# Altium schematic sheet TOPSHEET.SchDoc: TOPSHEET
size A4; Date: 31 08 2013; Author: Rachid AKKOUCHE; CompanyName: MDI; DrawnBy: Rachid AKKOUCHE; Engineer: Rachid AKKOUCHE; Organization: RASoftware; Address1: 52 J03 rue de la crèche; Address2: 77100 MEAUX; Address3: FRANCE; DocumentNumber: BRA2013090103C1; Revision: C; SheetNumber: 1; SheetTotal: 4; Telephone: +33651604047; Email: rachid.akkouche@wanadoo.fr; Dessinepar: -; Verifiepar: -; Time: 13:22
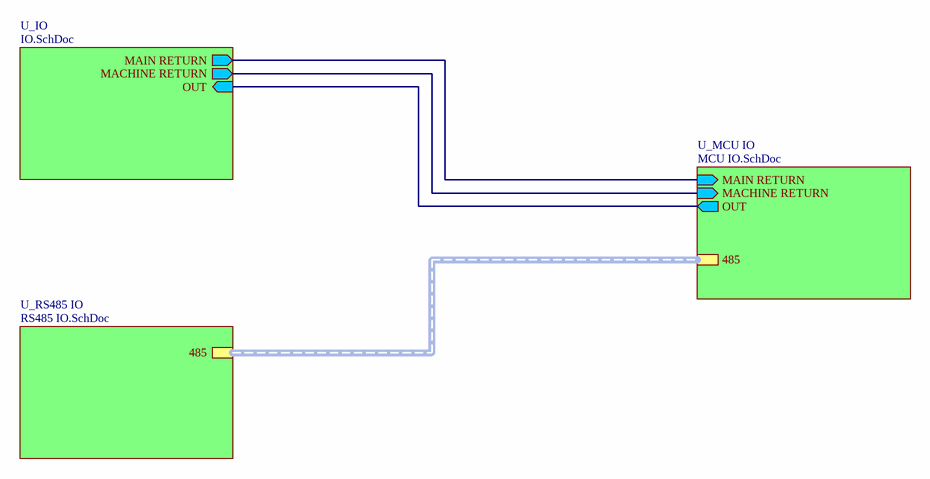
[diagram p0: TOPSHEET.SchDoc]

## Sub-sheets
U_IO = IO.SchDoc: MAIN RETURN (out), OUT (in), MACHINE RETURN (out)
U_MCU IO = MCU IO.SchDoc: MAIN RETURN (in), 485 (harness EIA-485), OUT (out), MACHINE RETURN (in)
U_RS485 IO = RS485 IO.SchDoc: 485 (harness EIA-485)

## Nets
(unnamed): sheet U_IO/MAIN RETURN, sheet U_MCU IO/MAIN RETURN
(unnamed): sheet U_IO/OUT, sheet U_MCU IO/OUT
(unnamed): sheet U_IO/MACHINE RETURN, sheet U_MCU IO/MACHINE RETURN

## Buses and harness runs
harness sheet U_MCU IO/485 = sheet U_RS485 IO/485

## Notes on the sheet
- Ce document est la propriété de
- Project:
- Il ne peut être divulgué sans l'accord écrit de l'un de ses représentants dûment mandaté
- Title:
- Number:
- Date:
- Time:
- Size:
- A4
- Revision:
- Sheet
- of
- 52 J03 rue de la crèche
- Draw by:
- 77100 Meaux